# EAGLE design HyperDriver (EAGLE 9.2.0)
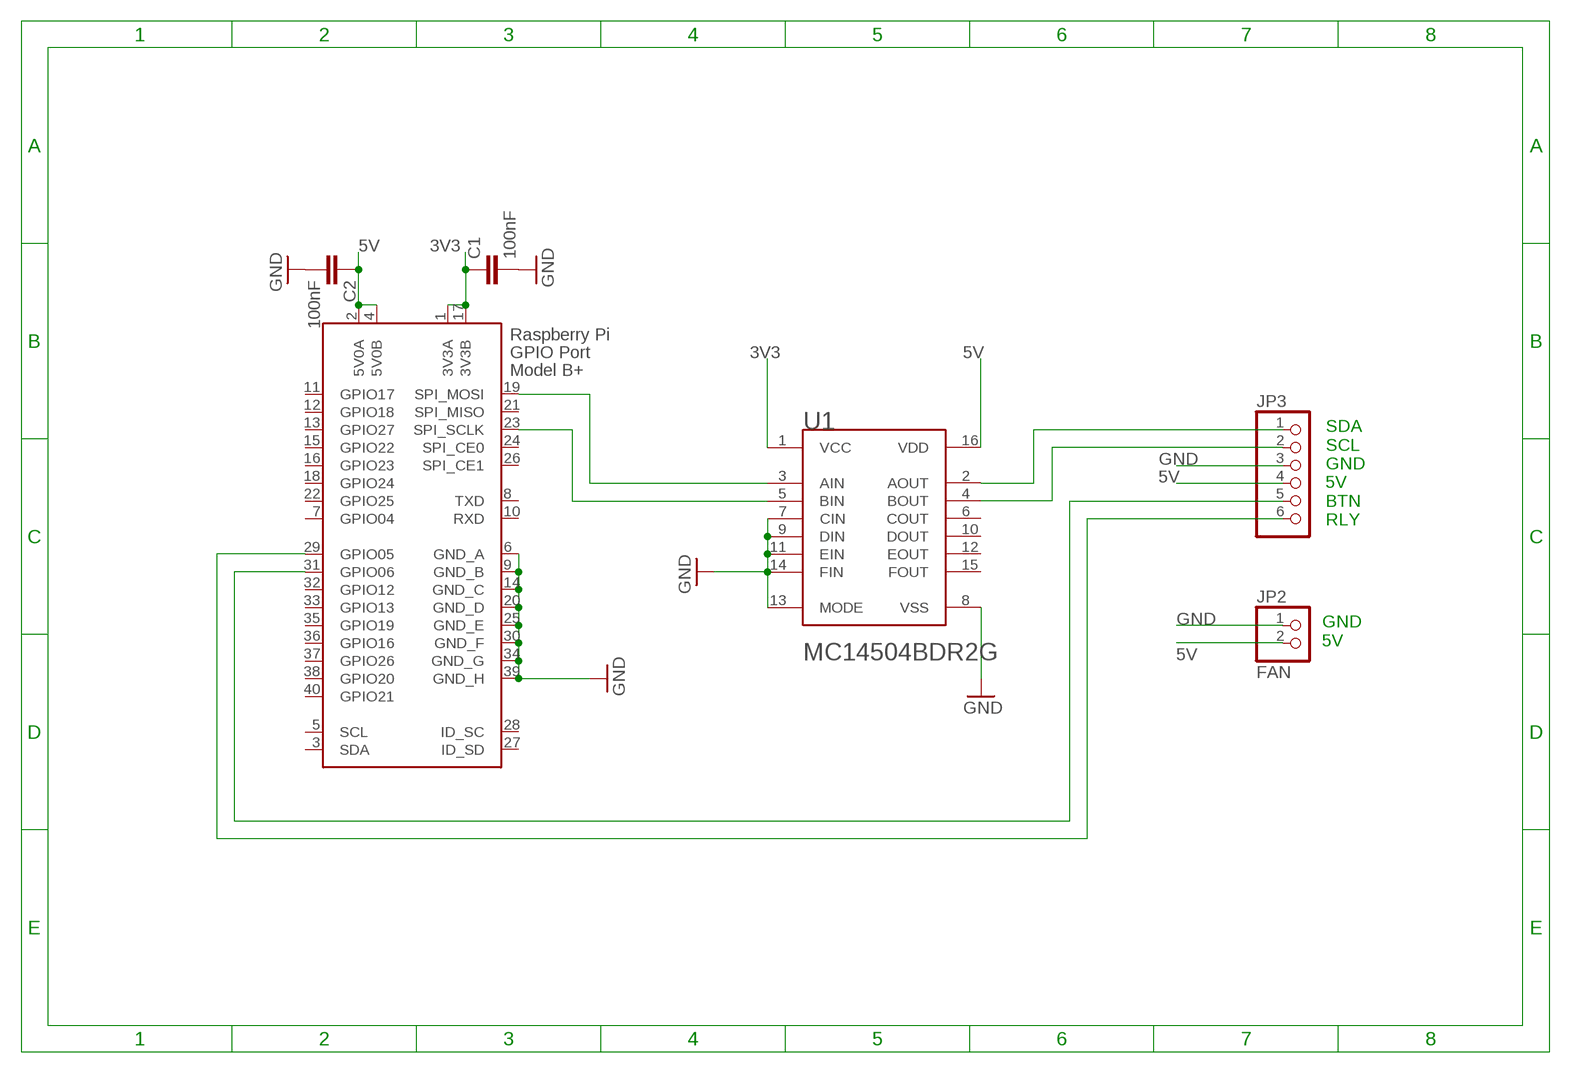
[diagram p0: schematic, sheet 1]

## Parts
C1  100nF  C-EUC0805K  [C0805K]
C2  100nF  C-EUC0805K  [C0805K]
JP2  FAN  PINHD-1X2  [1X02]
JP3  PINHD-1X6B  [1X06-BIG]
U1  ON_SEMICONDUCTOR_MC14504BDR2GON_SEMICONDUCTOR_MC14504BDR2G_0_1  [ON_SEMICONDUCTOR_MC14504BDR2G_1]
X1  RASPI_GPIO_B+#_PIN  [RASPI_GPIO_B+_PIN]

## Nets
3V3: C1.1 U1.1(VCC) X1.1(3V3A) X1.17(3V3B)
5V: C2.1 JP2.2 JP3.4 U1.16(VDD) X1.2(5V0A) X1.4(5V0B)
GND: C1.2 C2.2 JP2.1 JP3.3 U1.7(CIN) U1.8(VSS) U1.9(DIN) U1.11(EIN) U1.13(MODE) U1.14(FIN) X1.6(GND_A) X1.9(GND_B) X1.14(GND_C) X1.20(GND_D) X1.25(GND_E) X1.30(GND_F) X1.34(GND_G) X1.39(GND_H)
N$1: JP3.1 U1.2(AOUT)
N$2: JP3.6 X1.29(GPIO05)
N$3: JP3.5 X1.31(GPIO06)
N$4: U1.3(AIN) X1.19(SPI_MOSI)
N$5: U1.5(BIN) X1.23(SPI_SCLK)
N$6: JP3.2 U1.4(BOUT)
Unconnected: U1.6(COUT) U1.10(DOUT) U1.12(EOUT) U1.15(FOUT) X1.3(SDA) X1.5(SCL) X1.7(GPIO04) X1.8(TXD) X1.10(RXD) X1.11(GPIO17) X1.12(GPIO18) X1.13(GPIO27) X1.15(GPIO22) X1.16(GPIO23) X1.18(GPIO24) X1.21(SPI_MISO) X1.22(GPIO25) X1.24(SPI_CE0) X1.26(SPI_CE1) X1.27(ID_SD) X1.28(ID_SC) X1.32(GPIO12) X1.33(GPIO13) X1.35(GPIO19) X1.36(GPIO16) X1.37(GPIO26) X1.38(GPIO20) X1.40(GPIO21)

## Notes on the sheet
- SDA
  SCL
  GND
  5V
  BTN
  RLY
- GND
  5V

## Library data of the parts
C1 C2 = rcl:C-EU: CAPACITOR, European symbol; SPICEPREFIX: C
JP2 = pinhead:PINHD-1X2: PIN HEADER
JP3 = adafruit:PINHD-1X6: PIN HEADER
U1 = ON Semiconductor - MC14504BDR2G:ON_SEMICONDUCTOR_MC14504BDR2G: Voltage Level Translator Unidirectional 1 Circuit 6 Channel 16-SOIC; AMBIENT_TEMPERATURE_RANGE_HIGH: +125°C; AMBIENT_TEMPERATURE_RANGE_LOW: -55°C; AUTOMOTIVE: No; CENTROID_NOT_SPECIFIED: No; DATASHEET: https://www.onsemi.com/pub/Collateral/MC14504B-D.PDF; DEVICE_CLASS_L1: Integrated Circuits (ICs); DEVICE_CLASS_L2: Logic ICs; DEVICE_CLASS_L3: Voltage Level Shifters; DIGIKEY_DESCRIPTION: IC TRNSLTR UNIDIRECTIONAL 16SOIC; DIGIKEY_PART_NUMBER: MC14504BDR2GOSCT-ND; FOOTPRINT_PARAMETERS_1: {"fp_type":"SOIC_narrow","params":{"N":{"nom":16,"long name":"Number of leads","min":null,"max":null,"short name":"N","type":"count"},"A":{"nom":false,"long name":"Height","min":1350000,"max":1750000,"short name":"A","type":"measurement"},"A1":{"nom":false,"long name":"Package clearance","min":100000,"max":250000,"short name":"A1","type":"measurement"},"A2":{"nom":false,"long name":"Package height","min":1100000,"max":1650000,"short name":"A2","type":"measurement"},"D":{"nom":false,"long name":"Package length","min":9800000,"max":10000000,"short name":"D","type":"measurement"},"E":{"nom":false,"long name":"Width w/ leads","min":5800000,"max":6200000,"short name":"E","type":"measurement"},"E1":{"nom":false,"long name":"Package width","min":3800000,"max":4000000,"short name":"E1","type":"measurement"},"B":{"nom":false,"long name":"Lead width","min":350000,"max":490000,"short name":"B","type":"measurement"},"C":{"nom":false,"long name":"Lead thickness","min":190000,"max":250000,"short name":"C","type":"measurement"},"e":{"nom":1270000,"long name":"Lead pitch","min":null,"max":null,"short name":"e","type":"measurement"},"L":{"nom":false,"long name":"Lead foot length","min":400000,"max":1250000,"short name":"L","type":"measurement"},"PHI":{"nom":false,"long name":"Lead foot angle","min":0,"max":7000000,"short name":"PHI","type":"measurement"},"HT":{"default":"No","long name":"Thermal pad","type":"multichoiceparent","short name":"HT","children":[]},"offset x":{"nom":0,"long name":"X Center offset","min":null,"max":null,"short name":"offset x","type":"measurement"},"offset y":{"nom":0,"long name":"Y Center offset","min":null,"max":null,"short name":"offset y","type":"measurement"},"LS":{"default":"Rounded rectangle","long name":"Land shape","type":"multichoice","short name":"LS"},"LS1":{"default":"Rectangle","long name":"Land shape (Pin 1)","type":"multichoice","short name":"LS1"},"solder toe":{"nom":550000,"long name":"Solder fillet (toe)","min":null,"max":null,"short name":"solder toe","type":"fixedmeasurement"},"solder heel":{"nom":450000,"long name":"Solder fillet (heel)","min":null,"max":null,"short name":"solder heel","type":"fixedmeasurement"},"solder side":{"nom":50000,"long name":"Solder fillet (side)","min":null,"max":null,"short name":"solder side","type":"fixedmeasurement"},"courtyard":{"nom":500000,"long name":"Courtyard","min":null,"max":null,"short name":"courtyard","type":"fixedmeasurement"},"SF":{"default":"A","long name":"Packing level","type":"multichoiceparent","short name":"SF","help":"http://support.upverter.com/customer/portal/articles/978783-what-is-a-footprint-packing-level","children":["solder toe","solder heel","solder side","courtyard"]}}}; FOOTPRINT_PARAMETERS_2: {"fp_type":"SOIC_narrow","params":{"N":{"nom":16,"long name":"Number of leads","min":null,"max":null,"short name":"N","type":"count"},"A":{"nom":false,"long name":"Height","min":1350000,"max":1750000,"short name":"A","type":"measurement"},"A1":{"nom":false,"long name":"Package clearance","min":100000,"max":250000,"short name":"A1","type":"measurement"},"A2":{"nom":false,"long name":"Package height","min":1100000,"max":1650000,"short name":"A2","type":"measurement"},"D":{"nom":false,"long name":"Package length","min":9800000,"max":10000000,"short name":"D","type":"measurement"},"E":{"nom":false,"long name":"Width w/ leads","min":5800000,"max":6200000,"short name":"E","type":"measurement"},"E1":{"nom":false,"long name":"Package width","min":3800000,"max":4000000,"short name":"E1","type":"measurement"},"B":{"nom":false,"long name":"Lead width","min":350000,"max":490000,"short name":"B","type":"measurement"},"C":{"nom":false,"long name":"Lead thickness","min":190000,"max":250000,"short name":"C","type":"measurement"},"e":{"nom":1270000,"long name":"Lead pitch","min":null,"max":null,"short name":"e","type":"measurement"},"L":{"nom":false,"long name":"Lead foot length","min":400000,"max":1250000,"short name":"L","type":"measurement"},"PHI":{"nom":false,"long name":"Lead foot angle","min":0,"max":7000000,"short name":"PHI","type":"measurement"},"HT":{"default":"No","long name":"Thermal pad","type":"multichoiceparent","short name":"HT","children":[]},"offset x":{"nom":0,"long name":"X Center offset","min":null,"max":null,"short name":"offset x","type":"measurement"},"offset y":{"nom":0,"long name":"Y Center offset","min":null,"max":null,"short name":"offset y","type":"measurement"},"LS":{"default":"Rounded rectangle","long name":"Land shape","type":"multichoice","short name":"LS"},"LS1":{"default":"Rectangle","long name":"Land shape (Pin 1)","type":"multichoice","short name":"LS1"},"solder toe":{"nom":350000,"long name":"Solder fillet (toe)","min":null,"max":null,"short name":"solder toe","type":"fixedmeasurement"},"solder heel":{"nom":350000,"long name":"Solder fillet (heel)","min":null,"max":null,"short name":"solder heel","type":"fixedmeasurement"},"solder side":{"nom":30000,"long name":"Solder fillet (side)","min":null,"max":null,"short name":"solder side","type":"fixedmeasurement"},"courtyard":{"nom":250000,"long name":"Courtyard","min":null,"max":null,"short name":"courtyard","type":"fixedmeasurement"},"SF":{"default":"B","long name":"Packing level","type":"multichoiceparent","short name":"SF","help":"http://support.upverter.com/customer/portal/articles/978783-what-is-a-footprint-packing-level","children":["solder toe","solder heel","solder side","courtyard"]}}}; FOOTPRINT_PARAMETERS_3: {"fp_type":"SOIC_narrow","params":{"N":{"nom":16,"long name":"Number of leads","min":null,"max":null,"short name":"N","type":"count"},"A":{"nom":false,"long name":"Height","min":1350000,"max":1750000,"short name":"A","type":"measurement"},"A1":{"nom":false,"long name":"Package clearance","min":100000,"max":250000,"short name":"A1","type":"measurement"},"A2":{"nom":false,"long name":"Package height","min":1100000,"max":1650000,"short name":"A2","type":"measurement"},"D":{"nom":false,"long name":"Package length","min":9800000,"max":10000000,"short name":"D","type":"measurement"},"E":{"nom":false,"long name":"Width w/ leads","min":5800000,"max":6200000,"short name":"E","type":"measurement"},"E1":{"nom":false,"long name":"Package width","min":3800000,"max":4000000,"short name":"E1","type":"measurement"},"B":{"nom":false,"long name":"Lead width","min":350000,"max":490000,"short name":"B","type":"measurement"},"C":{"nom":false,"long name":"Lead thickness","min":190000,"max":250000,"short name":"C","type":"measurement"},"e":{"nom":1270000,"long name":"Lead pitch","min":null,"max":null,"short name":"e","type":"measurement"},"L":{"nom":false,"long name":"Lead foot length","min":400000,"max":1250000,"short name":"L","type":"measurement"},"PHI":{"nom":false,"long name":"Lead foot angle","min":0,"max":7000000,"short name":"PHI","type":"measurement"},"HT":{"default":"No","long name":"Thermal pad","type":"multichoiceparent","short name":"HT","children":[]},"offset x":{"nom":0,"long name":"X Center offset","min":null,"max":null,"short name":"offset x","type":"measurement"},"offset y":{"nom":0,"long name":"Y Center offset","min":null,"max":null,"short name":"offset y","type":"measurement"},"LS":{"default":"Rounded rectangle","long name":"Land shape","type":"multichoice","short name":"LS"},"LS1":{"default":"Rectangle","long name":"Land shape (Pin 1)","type":"multichoice","short name":"LS1"},"solder toe":{"nom":150000,"long name":"Solder fillet (toe)","min":null,"max":null,"short name":"solder toe","type":"fixedmeasurement"},"solder heel":{"nom":250000,"long name":"Solder fillet (heel)","min":null,"max":null,"short name":"solder heel","type":"fixedmeasurement"},"solder side":{"nom":10000,"long name":"Solder fillet (side)","min":null,"max":null,"short name":"solder side","type":"fixedmeasurement"},"courtyard":{"nom":100000,"long name":"Courtyard","min":null,"max":null,"short name":"courtyard","type":"fixedmeasurement"},"SF":{"default":"C","long name":"Packing level","type":"multichoiceparent","short name":"SF","help":"http://support.upverter.com/customer/portal/articles/978783-what-is-a-footprint-packing-level","children":["solder toe","solder heel","solder side","courtyard"]}}}; FOOTPRINT_URL: https://www.onsemi.com/pub/Collateral/751B-05.PDF; FOOTPRINT_VARIANT_NAME_0: Recommended_Land_Pattern; FOOTPRINT_VARIANT_NAME_1: IPC_A; FOOTPRINT_VARIANT_NAME_2: IPC_B; FOOTPRINT_VARIANT_NAME_3: IPC_C; HEIGHT: 1.75mm; IPC_LAND_PATTERN_NAME: SOIC127P600X155-16; LEAD_FREE: Yes; LOGIC_FUNCTION_DESC: Non-Inverting; MAX_SUPPLY_VOLTAGE: 18V; MF: ON Semiconductor; MFG_PACKAGE_IDENT: 751B-05; MFG_PACKAGE_IDENT_DATE: 12/2006; MFG_PACKAGE_IDENT_REV: K; MIN_SUPPLY_VOLTAGE: 3V; MOUSER_DESCRIPTION: Voltage Level Shifter CMOS/TTL to CMOS 6 Unidirectional Automotive 16-Pin SOIC T/R; MOUSER_PART_NUMBER: 863-MC14504BDR2G; MPN: MC14504BDR2G; NUMBER_OF_CIRCUITS: 6; NUMBER_OF_INPUTS: 1; NUMBER_OF_OUTPUTS: 1; NUM_PINS: 16; OCTOPART_PART_NUMBER: a116681b6feb7ed1; PACKAGE: SOIC16; PREFIX: U; PROPAGATION_DELAY: 175ns; QUIESCENT_CURRENT: 0.0005-2500uA; ROHS: Yes; STANDOFF_HEIGHT: 0.25mm; SYMBOL_0_0: Standard; TYPE: integrated circuit; VERIFICATION_VERSION: 0.0.0.3; V_A_MAX: 18V; V_A_MIN: 3V; V_B_MAX: 18V; V_B_MIN: 3V
X1 = raspberrypi_bastelstube_v13:RASPI_GPIO_B+#: 2x20 header connector, all pins connected

## Board
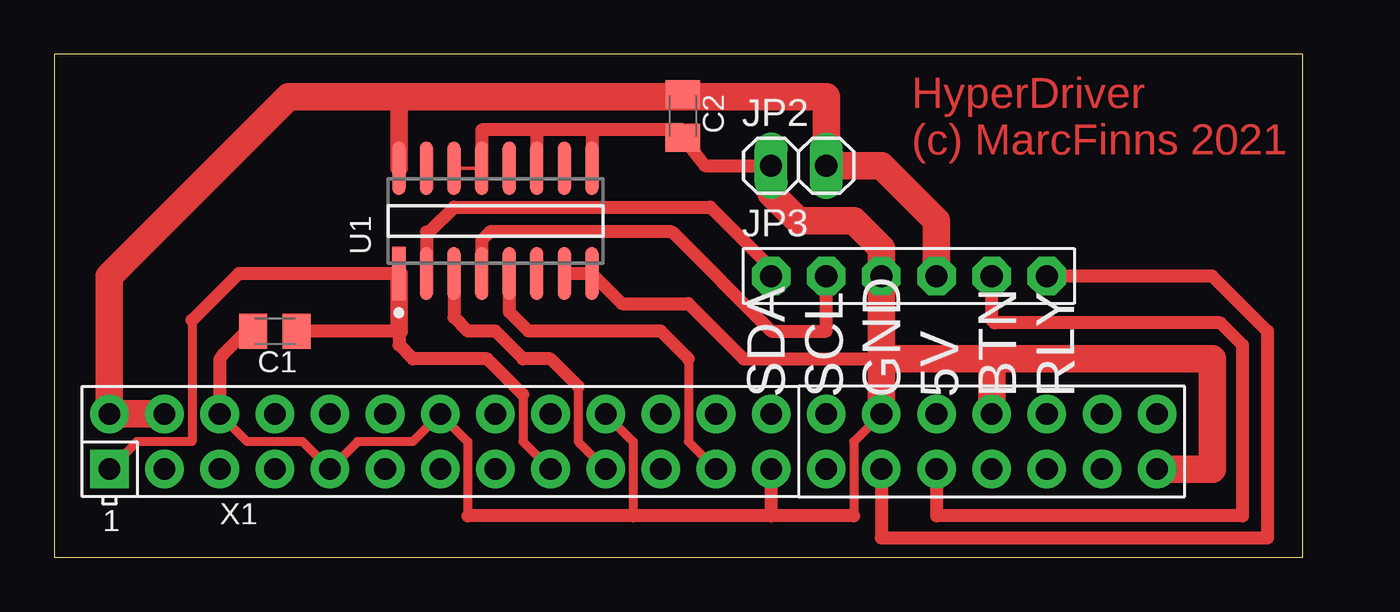
[diagram p1: board, top side]

Size 57.51 x 23.16 mm. Coordinates in mm from the lower left corner, seen from the top.
Outline: 0,0 57.51,0 57.51,23.16 0,23.16 0,0
Copper layers (1*16): Top 0.035mm / dielectric 1.5mm / Bottom 0.035mm
Design rules "default": minimum track width 6mil, minimum drill 0.35mm, track to track 6mil, track to pad 6mil, pad to pad 6mil, via to via 6mil, smd to smd 6mil, copper to edge 40mil, drill to drill 6mil, minimum pad ring 10mil, minimum via ring 8mil, stop-mask expansion 4mil, vias tented up to drill 0mil, thermal gap 10mil

### Footprints (pad centres in the part's own frame; a part is rotated, then mirrored left to right if it is on the bottom)
C0805K = smd 1.3 x 1.6: 1 -1,0; 2 1,0
1X02 = drill 1.016 long: 1 -1.27,0; 2 1.27,0
1X06-BIG = drill 1.016 pad 1.778 octagon: 1 -6.35,0; 2 -3.81,0; 3 -1.27,0; 4 1.27,0; 5 3.81,0; 6 6.35,0
ON_SEMICONDUCTOR_MC14504BDR2G_1 = smd 2.454 x 0.607: 1 -2.426,4.445; 2 -2.426,3.175; 3 -2.426,1.905; 4 -2.426,0.635; 5 -2.426,-0.635; 6 -2.426,-1.905; 7 -2.426,-3.175; 8 -2.426,-4.445; 9 2.426,-4.445; 10 2.426,-3.175; 11 2.426,-1.905; 12 2.426,-0.635; 13 2.426,0.635; 14 2.426,1.905; 15 2.426,3.175; 16 2.426,4.445
RASPI_GPIO_B+_PIN = drill 1 pad 1.778 square: 1 -24.13,-1.27 | drill 1 pad 1.778: 2 -24.13,1.27; 3 -21.59,-1.27; 4 -21.59,1.27; 5 -19.05,-1.27; 6 -19.05,1.27; 7 -16.51,-1.27; 8 -16.51,1.27; 9 -13.97,-1.27; 10 -13.97,1.27; 11 -11.43,-1.27; 12 -11.43,1.27; 13 -8.89,-1.27; 14 -8.89,1.27; 15 -6.35,-1.27; 16 -6.35,1.27; 17 -3.81,-1.27; 18 -3.81,1.27; 19 -1.27,-1.27; 20 -1.27,1.27; 21 1.27,-1.27; 22 1.27,1.27; 23 3.81,-1.27; 24 3.81,1.27; 25 6.35,-1.27; 26 6.35,1.27; 27 8.89,-1.27; 28 8.89,1.27; 29 11.43,-1.27; 30 11.43,1.27; 31 13.97,-1.27; 32 13.97,1.27; 33 16.51,-1.27; 34 16.51,1.27; 35 19.05,-1.27; 36 19.05,1.27; 37 21.59,-1.27; 38 21.59,1.27; 39 24.13,-1.27; 40 24.13,1.27

### Placement (x,y rotation side)
C1  10.16,10.41 180 top
C2  28.96,20.32 270 top
JP2  34.29,18.03 0 top
JP3  39.37,12.95 0 top
U1  20.32,15.49 90 top
X1  26.67,5.33 0 top

### Tracks (layer width: path | path; a pad name or v marks a point on that pad's centre or on a via)
3V3
  Top 0.406: 21.59,7.49 21.59,5.33 X1.17 | X1.1 3.81,5.33 6.35,5.33 6.35,10.92
  Top 0.61: 21.59,7.49 19.94,9.14 16.51,9.14 15.88,9.78 15.88,10.41 C1.1 | U1.1 8.5,13.07 6.35,10.92
  Top 0.813: U1.1 15.88,10.41
5V
  Top 0.152: 28.83,20.81 28.8,21.08 28.8,21.21 28.96,21.39 C2.1
  Top 0.813: 15.88,21.21 U1.16
  Top 1.27: JP3.4 40.64,15.49 38.1,18.03 JP2.2 35.56,21.21 28.8,21.21 15.88,21.21 10.79,21.21 5.35,15.76 2.54,12.95 X1.2 X1.4
GND
  Top 0.152: X1.6 7.35,6.87 | JP3.3 37.99,13.07 | U1.13 U1.14 | 24.77,19.56 24.64,19.69 | 8.84,10.41 C1.2
  Top 0.406: X1.6 8.89,5.33 11.43,5.33 X1.9 13.97,5.33 16.51,5.33 X1.14 19.05,5.33 19.05,1.9 | X1.20 26.67,5.33 26.67,1.9 | 36.83,1.9 36.83,5.33 X1.30
  Top 0.61: U1.7 U1.8 26.15,11.68 29.21,11.68 31.75,9.14 39.37,9.14 | 33.02,1.9 26.67,1.9 19.05,1.9 | 36.83,1.9 33.02,1.9 | X1.25 33.02,1.9 | U1.13 19.68,19.69 22.23,19.69 | 22.23,19.69 U1.11 | 22.23,19.69 24.64,19.69 28.96,19.69 C2.2 29.97,18.03 JP2.1 | 24.77,19.56 U1.9 | X1.6 7.62,9.14 7.77,9.35 8.84,10.41
  Top 1.27: 38.1,9.14 X1.30 | 38.1,9.14 JP3.3 38.1,14.22 36.83,15.49 34.29,15.49 33.02,16.76 JP2.1 | 43.18,9.14 39.37,9.14 38.1,9.14 | 43.18,9.14 X1.34 | X1.39 53.34,4.06 53.34,9.14 43.18,9.14
N$1
  Top 0.152: 17.27,14.99 17.14,14.99
  Top 0.61: 17.27,14.99 18.41,16.13 30.23,16.13 33.02,13.34 JP3.1 | 17.14,14.99 U1.2
N$2
  Top 0.61: X1.29 38.1,0.89 55.88,0.89 55.88,10.41 53.34,12.95 JP3.6
N$3
  Top 0.152: 43.31,10.79 43.18,10.92
  Top 0.61: X1.31 40.64,1.9 54.74,1.9 54.74,9.78 53.72,10.79 43.31,10.79 | 43.18,10.92 JP3.5
N$4
  Top 0.406: X1.19 24.13,5.33 24.13,7.87
  Top 0.61: 24.13,7.87 22.86,9.14 21.59,9.14 20.32,10.41 19.05,10.41 18.41,11.05 U1.3
N$5
  Top 0.406: 29.21,9.14 29.21,5.33 X1.23
  Top 0.61: U1.5 20.95,11.3 21.84,10.41 27.94,10.41 29.21,9.14
N$6
  Top 0.61: U1.4 19.68,14.61 20.07,14.99 28.45,14.99 33.02,10.41 35.56,10.41 JP3.2

### Text on the board
Top: HyperDriver / (c) MarcFinns 2021
tNames: SDA / SCL / GND / 5V / BTN / RLY